# EAGLE design remote_display (EAGLE 7.2.0)
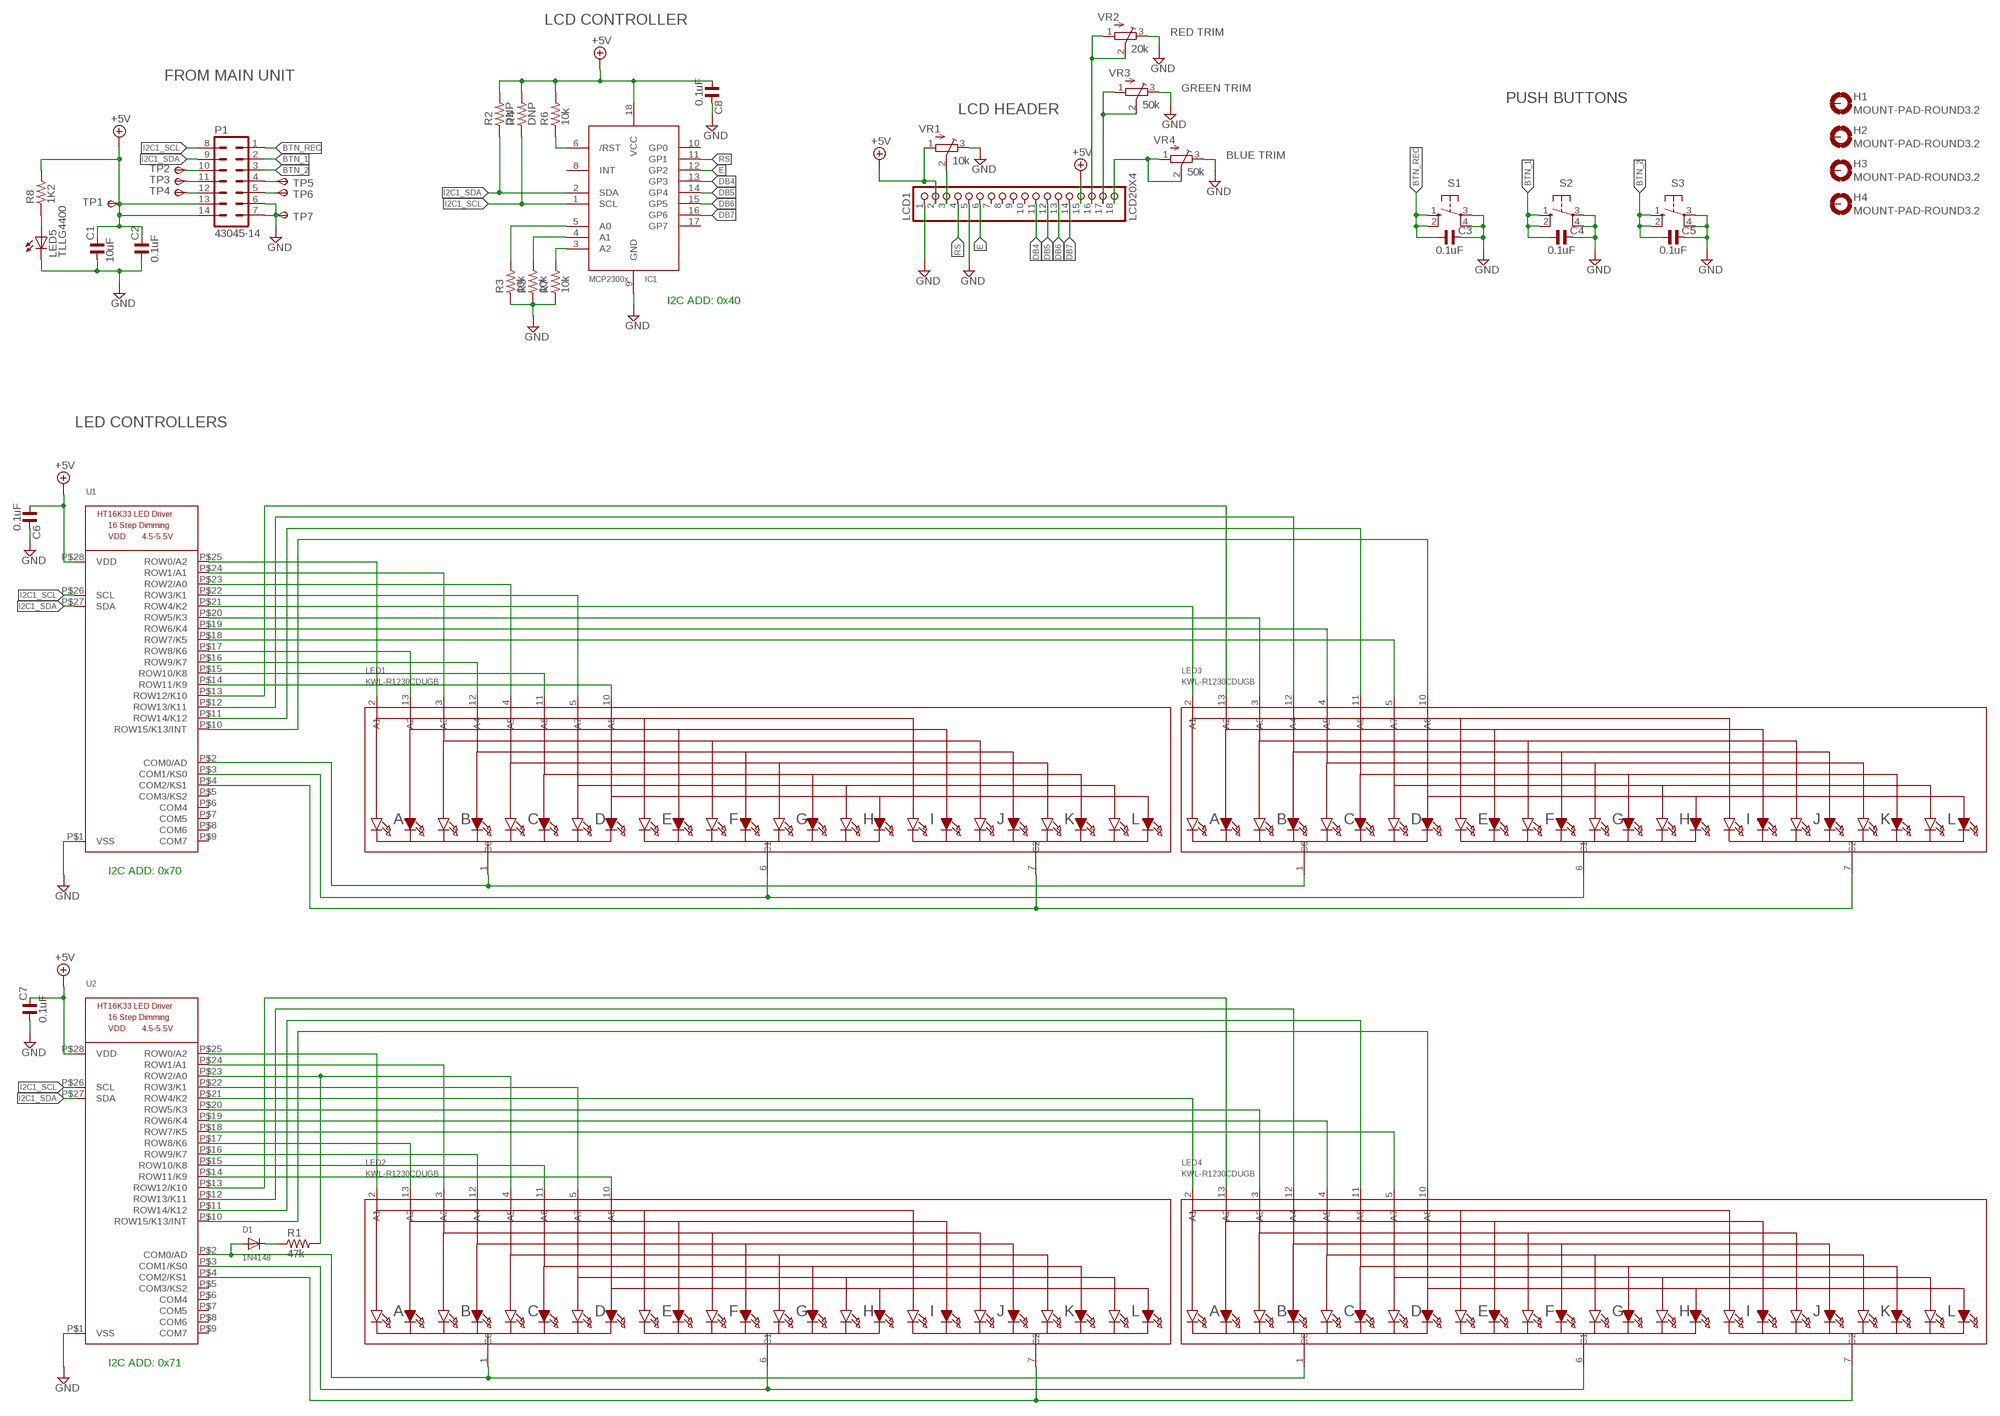
[diagram p0: schematic, sheet 1]

## Parts
C1  10uF  C_0805  [C0805]
C2  0.1uF  C_0805  [C0805]
C3  0.1uF  C_0805  [C0805]
C4  0.1uF  C_0805  [C0805]
C5  0.1uF  C_0805  [C0805]
C6  0.1uF  C_0805  [C0805]
C7  0.1uF  C_0805  [C0805]
C8  0.1uF  C_0805  [C0805]
D1  1N4148  DIODESOD-323F  [SOD-323F]
H1  MOUNT-PAD-ROUND3.2  [3,2-PAD]
H2  MOUNT-PAD-ROUND3.2  [3,2-PAD]
H3  MOUNT-PAD-ROUND3.2  [3,2-PAD]
H4  MOUNT-PAD-ROUND3.2  [3,2-PAD]
IC1  MCP2300X/SO  [SO18W]
LCD1  LCD20X4  [LCD20X4]
LED1  KWL-R1230CDUGB  [SEGMENT_BICOL_BL-AR12Z3010]
LED2  KWL-R1230CDUGB  [SEGMENT_BICOL_BL-AR12Z3010]
LED3  KWL-R1230CDUGB  [SEGMENT_BICOL_BL-AR12Z3010]
LED4  KWL-R1230CDUGB  [SEGMENT_BICOL_BL-AR12Z3010]
LED5  TLLG4400  [LED3MM]
P1  43045-14  [43045-14]
R1  47k  R_0805  [R0805]
R2  DNP  R_0805  [R0805]
R3  10k  R_0805  [R0805]
R4  DNP  R_0805  [R0805]
R5  10k  R_0805  [R0805]
R6  10k  R_0805  [R0805]
R7  10k  R_0805  [R0805]
R8  1K2  R_0805  [R0805]
S1  10-XX  [B3F-10XX]
S2  10-XX  [B3F-10XX]
S3  10-XX  [B3F-10XX]
TP1  TPSPAD1-13  [P1-13]
TP2  TPSPAD1-13  [P1-13]
TP3  TPSPAD1-13  [P1-13]
TP4  TPSPAD1-13  [P1-13]
TP5  TPSPAD1-13  [P1-13]
TP6  TPSPAD1-13  [P1-13]
TP7  TPSPAD1-13  [P1-13]
U1  HT16K33_SOP28  [SOP28_300MIL]
U2  HT16K33_SOP28  [SOP28_300MIL]
VR1  10k  TRIMPOTTC33X  [TC33X]
VR2  20k  TRIMPOTTC33X  [TC33X]
VR3  50k  TRIMPOTTC33X  [TC33X]
VR4  50k  TRIMPOTTC33X  [TC33X]

## Nets
+5V [Power]: C1.2 C2.2 C6.1 C7.2 C8.1 IC1.18(VCC) LCD1.2 LCD1.15 P1.13 P1.14 R2.2 R4.2 R6.2 R8.2 TP1.TP(PP) U1.P$28(VDD) U2.P$28(VDD) VR1.1(A)
BTN_1: C4.1 P1.2 S2.1(S) S2.2(S1)
BTN_2: C5.1 P1.3 S3.1(S) S3.2(S1)
BTN_REC: C3.1 P1.1 S1.1(S) S1.2(S1)
DB4: IC1.13(GP3) LCD1.11
DB5: IC1.14(GP4) LCD1.12
DB6: IC1.15(GP5) LCD1.13
DB7: IC1.16(GP6) LCD1.14
E: IC1.12(GP2) LCD1.6
GND [Ground]: C1.1 C2.1 C3.2 C4.2 C5.2 C6.2 C7.1 C8.2 IC1.9(GND) LCD1.1 LCD1.5 LED5.K(C) P1.6 P1.7 R3.1 R5.1 R7.1 S1.3(P) S1.4(P1) S2.3(P) S2.4(P1) S3.3(P) S3.4(P1) TP7.TP(PP) U1.P$1(VSS) U2.P$1(VSS) VR1.3(E) VR2.3(E) VR3.3(E) VR4.3(E)
I2C1_SCL: IC1.1(SCL) P1.8 R4.1 U1.P$26(SCL) U2.P$26(SCL)
I2C1_SDA: IC1.2(SDA) P1.9 R2.1 U1.P$27(SDA) U2.P$27(SDA)
N$1: LCD1.17 VR3.1(A) VR3.2(S)
N$2: D1.C R1.1
N$3: LCD1.3 VR1.2(S)
N$4: IC1.3(A2) R7.2
N$5: IC1.4(A1) R5.2
N$6: LED1.2(A1) U1.P$25(ROW0/A2)
N$7: LCD1.16 VR2.1(A) VR2.2(S)
N$8: LED1.7(C2) LED3.7(C2) U1.P$4(COM2/KS1)
N$9: IC1.6(/RST) R6.1
N$10: LED5.A R8.1
N$11: LED1.1(C0) LED3.1(C0) U1.P$2(COM0/AD)
N$12: LED1.6(C1) LED3.6(C1) U1.P$3(COM1/KS0)
N$13: LED1.3(A3) U1.P$24(ROW1/A1)
N$14: LED1.13(A2) U1.P$17(ROW8/K6)
N$15: LED1.12(A4) U1.P$16(ROW9/K7)
N$16: LED1.11(A6) U1.P$15(ROW10/K8)
N$17: LED1.10(A8) U1.P$14(ROW11/K9)
N$18: LED1.5(A7) U1.P$22(ROW3/K1)
N$19: LED1.4(A5) U1.P$23(ROW2/A0)
N$20: LED3.2(A1) U1.P$21(ROW4/K2)
N$21: LED3.3(A3) U1.P$20(ROW5/K3)
N$22: LED3.4(A5) U1.P$19(ROW6/K4)
N$23: LED3.5(A7) U1.P$18(ROW7/K5)
N$24: LED3.13(A2) U1.P$13(ROW12/K10)
N$25: IC1.5(A0) R3.2
N$26: P1.5 TP6.TP(PP)
N$27: LED3.12(A4) U1.P$12(ROW13/K11)
N$28: LED3.11(A6) U1.P$11(ROW14/K12)
N$29: LED3.10(A8) U1.P$10(ROW15/K13/INT)
N$30: D1.A LED2.1(C0) LED4.1(C0) U2.P$2(COM0/AD)
N$31: LED2.6(C1) LED4.6(C1) U2.P$3(COM1/KS0)
N$32: LED2.7(C2) LED4.7(C2) U2.P$4(COM2/KS1)
N$33: LED2.2(A1) U2.P$25(ROW0/A2)
N$34: LED2.3(A3) U2.P$24(ROW1/A1)
N$36: LED2.13(A2) U2.P$17(ROW8/K6)
N$37: LED2.12(A4) U2.P$16(ROW9/K7)
N$38: LED2.11(A6) U2.P$15(ROW10/K8)
N$39: LCD1.18 VR4.1(A) VR4.2(S)
N$40: LED2.10(A8) U2.P$14(ROW11/K9)
N$41: LED2.5(A7) U2.P$22(ROW3/K1)
N$42: LED2.4(A5) R1.2 U2.P$23(ROW2/A0)
N$43: LED4.2(A1) U2.P$21(ROW4/K2)
N$44: LED4.3(A3) U2.P$20(ROW5/K3)
N$45: LED4.4(A5) U2.P$19(ROW6/K4)
N$46: LED4.5(A7) U2.P$18(ROW7/K5)
N$47: LED4.13(A2) U2.P$13(ROW12/K10)
N$48: LED4.12(A4) U2.P$12(ROW13/K11)
N$49: LED4.11(A6) U2.P$11(ROW14/K12)
N$50: LED4.10(A8) U2.P$10(ROW15/K13/INT)
N$52: P1.4 TP5.TP(PP)
N$53: P1.12 TP4.TP(PP)
N$54: P1.11 TP3.TP(PP)
N$55: P1.10 TP2.TP(PP)
RS: IC1.11(GP1) LCD1.4
Unconnected: H1.B3,2(MOUNT) H2.B3,2(MOUNT) H3.B3,2(MOUNT) H4.B3,2(MOUNT) IC1.8(INT) IC1.10(GP0) IC1.17(GP7) LCD1.7 LCD1.8 LCD1.9 LCD1.10 U1.P$5(COM3/KS2) U1.P$6(COM4) U1.P$7(COM5) U1.P$8(COM6) U1.P$9(COM7) U2.P$5(COM3/KS2) U2.P$6(COM4) U2.P$7(COM5) U2.P$8(COM6) U2.P$9(COM7)

## Notes on the sheet
- LCD CONTROLLER
- RED TRIM
- FROM MAIN UNIT
- GREEN TRIM
- PUSH BUTTONS
- LCD HEADER
- BLUE TRIM
- I2C ADD: 0x40
- LED CONTROLLERS
- I2C ADD: 0x70
- I2C ADD: 0x71

## Library data of the parts
C1 = rc-master-smd:C_: NON-POLARIZED CAP; MPN: C2012X5R1E106K125AB; OC_NEWARK: 04X3278
C2-C8 = rc-master-smd:C_: NON-POLARIZED CAP; MPN: C2012X7R1H104K085AA; OC_NEWARK: 04X3288
D1 = Adafruit-bicolor-bargraph-24:DIODE: Diode SMADIODE - SMA Surface Mount Package 20V 1A Schottky Diode Digikey: 641-1014-6-ND DO-1N4148 - Through Hole Small Current Diode SOD-123 20V 1 A (.5mV Vf) Schottky Diode - Digikey: MBRX120TPMSCT-ND SOD-323 10V 570mA (.38mV Vf, 3ns) Schottky Diode - Digikey: ZLLS410CT-ND SOD-523 30V 30mA Schottky Diode (RB751S-40TE61) - Digikey: RB751S-40TE61CT-ND SOT23-R/W - SOT23 Package (R = Solder Paste/Reflow Ovens, W = Hand-Soldering) BAT54Film 40V 300mA - Digikey: 497-7162-1-ND; MPN: MMBT2222ALT3G; OC_NEWARK: 10N9478
H1-H4 = holes:MOUNT-PAD-ROUND: MOUNTING PAD, round; OC_NEWARK: unknown
IC1 = adafruit-i2cspilcdbackpack:MCP2300X: MCP23008 Inexpensive i2c i/o expander - 8 general purpose i/o pins with optional pullups; MF: MICROCHIP; MPN: MCP23008-E/SO; OC_NEWARK: 08J8738
LCD1 = dan:LCD20X4; OC_NEWARK: unknown
LED1-LED4 = Adafruit-bicolor-bargraph-24:KWL-R1230CDUGB; OC_NEWARK: unknown
LED5 = led:TLLG4400: Low Current (2mA) LED 3 mm Tinted Diffused Package color GREEN Source: Data sheet <http://www.farnell.com/datasheets/391098.pdf>; MF: VISHAY/TELEFUNKEN; MPN: TLLG4400; OC_FARNELL: 1612435; OC_NEWARK: 58K2496
P1 = con-molex-micro-fit:43045-14: HEADER; MPN: 43045-1400; OC_NEWARK: 55R8852
R1 = rc-master-smd:R_: RESISTOR; MPN: CRCW080547K0FKEAHP; OC_NEWARK: 41R4787
R2-R8 = rc-master-smd:R_: RESISTOR; MF: VISHAY/DALE; MPN: CRCW080510K0FKTA; OC_NEWARK: 05F1511
S1-S3 = switch-omron:10-XX: OMRON SWITCH; OC_FARNELL: 176432; OC_NEWARK: unknown
TP1-TP7 = testpad:TPS: TEST PIN; OC_NEWARK: unknown
U1 U2 = Adafruit-bicolor-bargraph-24:HT16K33_SOP28; OC_NEWARK: unknown
VR1 = adafruit-i2cspilcdbackpack:TRIMPOT: SMT trimmer potentiometer part number TC33X http://www.ladyada.net/library/eagle; MF: BOURNS, INC.; MPN: TC33X-2-103E; OC_NEWARK: 60H9648
VR2 = adafruit-i2cspilcdbackpack:TRIMPOT: SMT trimmer potentiometer part number TC33X http://www.ladyada.net/library/eagle; MPN: TC33X-2-203E; OC_NEWARK: 97M3839
VR3 VR4 = adafruit-i2cspilcdbackpack:TRIMPOT: SMT trimmer potentiometer part number TC33X http://www.ladyada.net/library/eagle; MPN: TC33X-2-503E; OC_NEWARK: 97M3841

## Net classes
1 Ground: width 0.635 mm
2 Power: width 0.508 mm

## Board
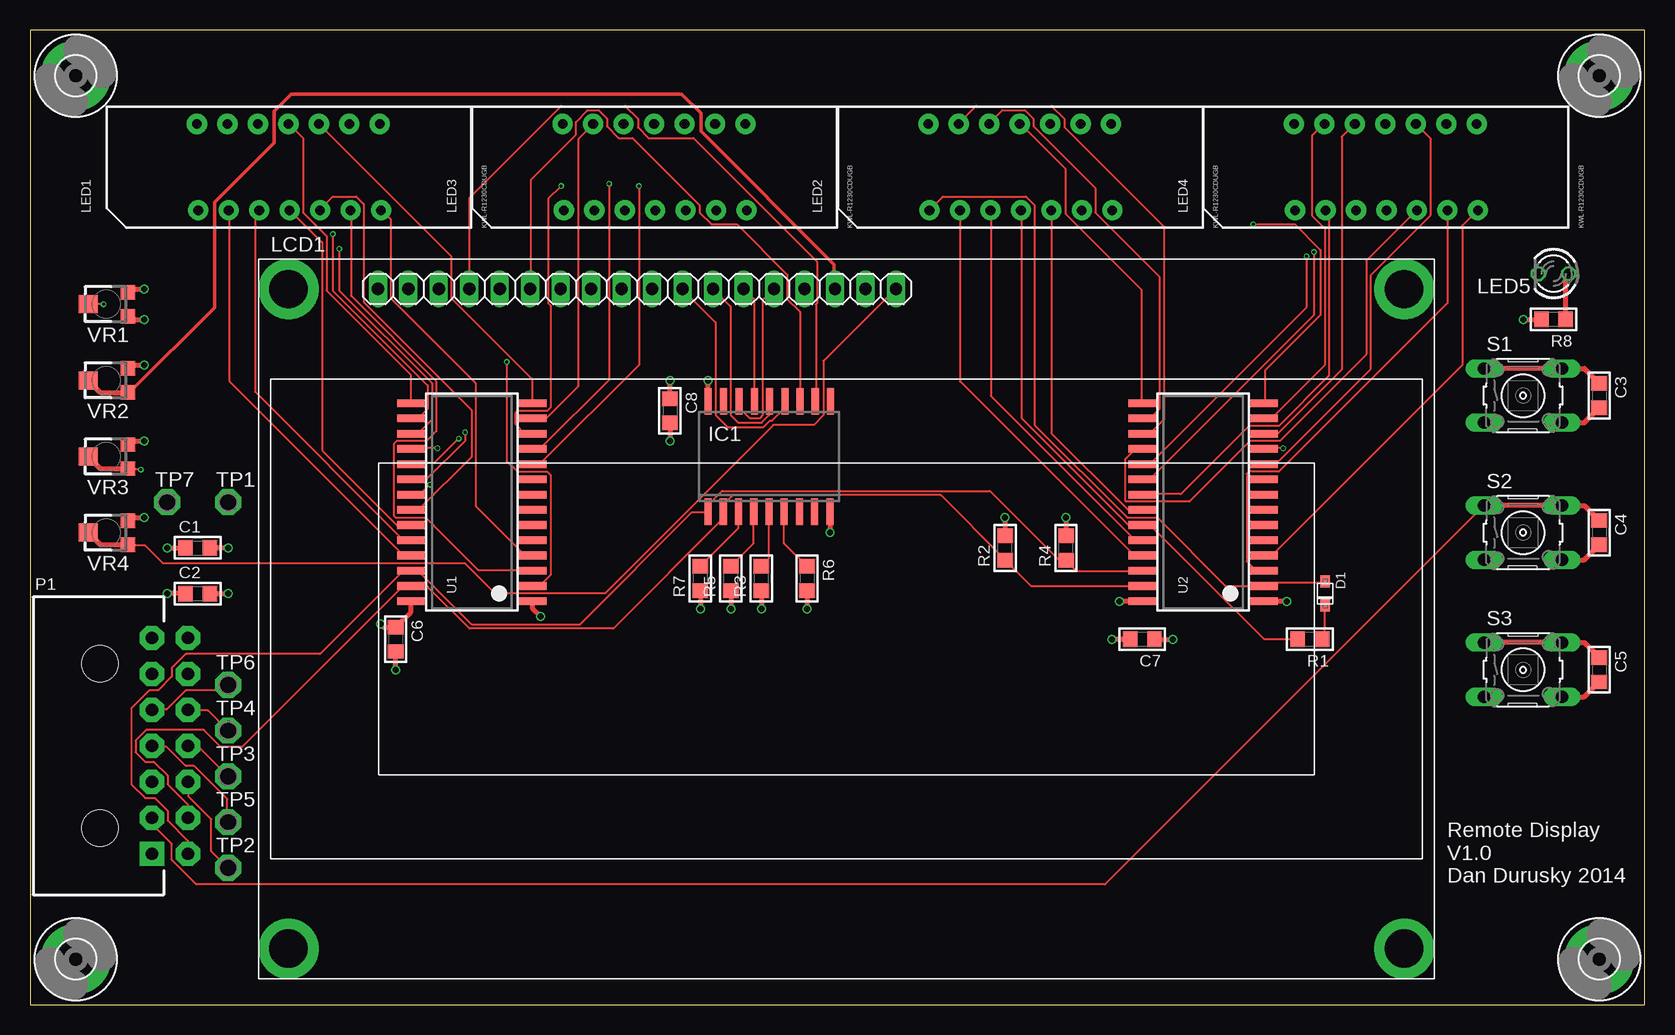
[diagram p1: board, top side]
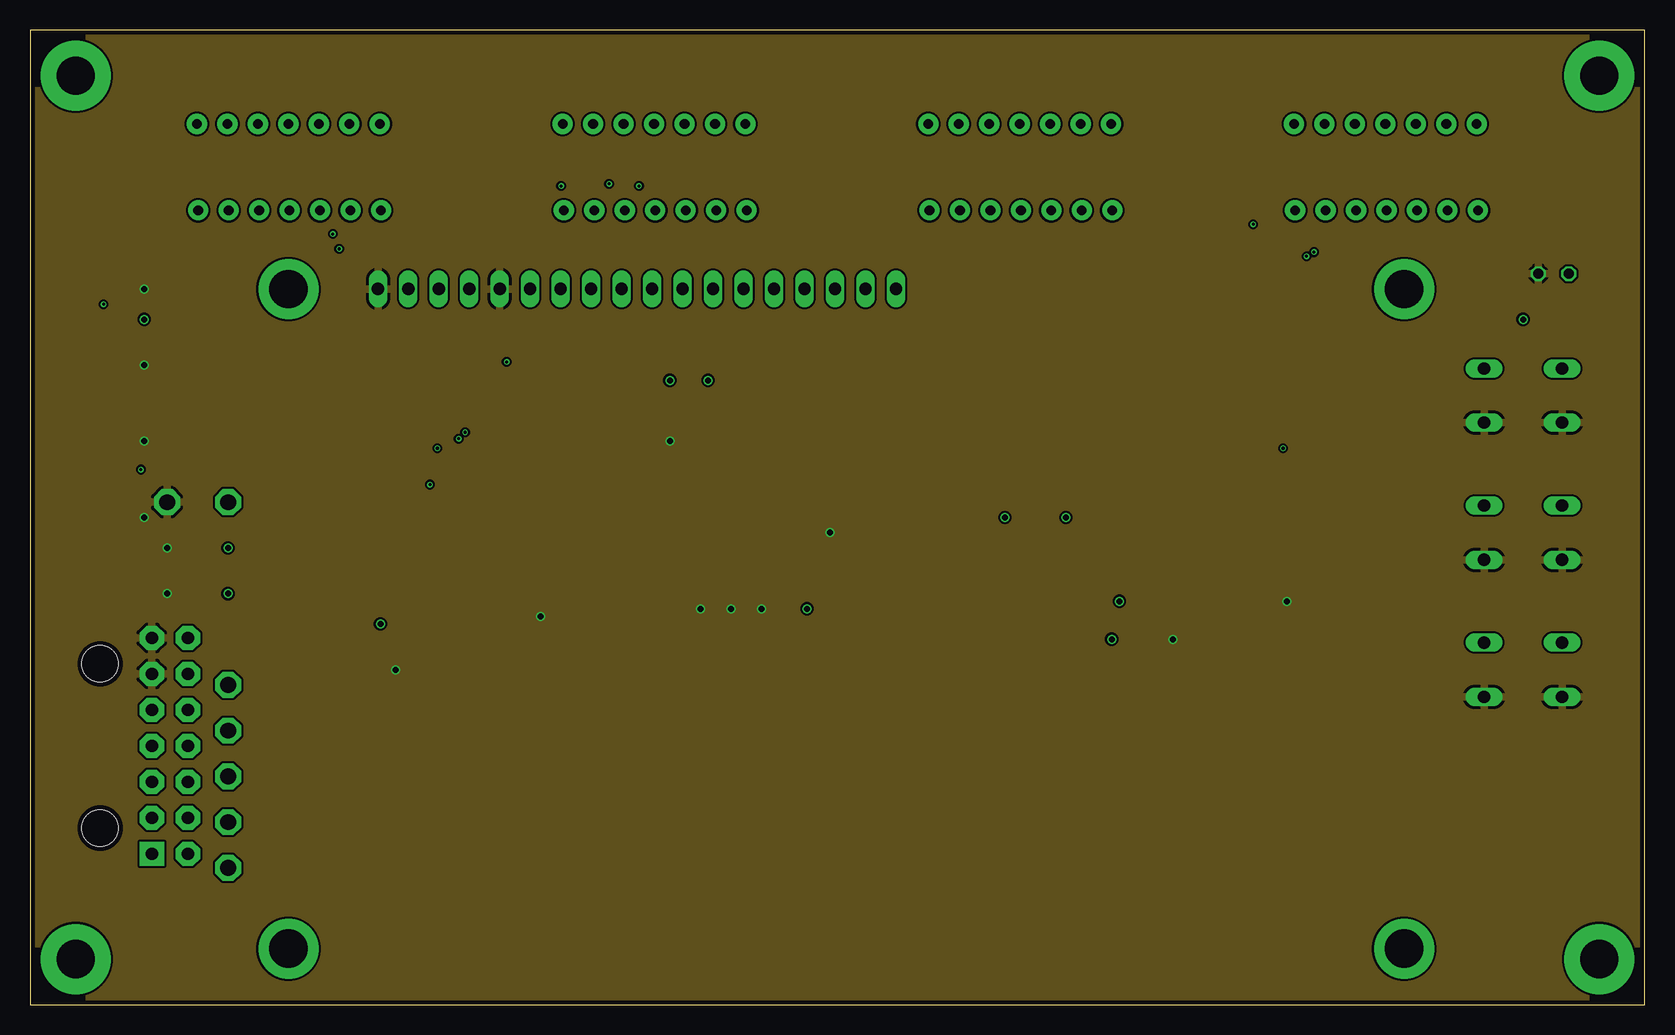
[diagram p2: board, inner layer GroundPlane]
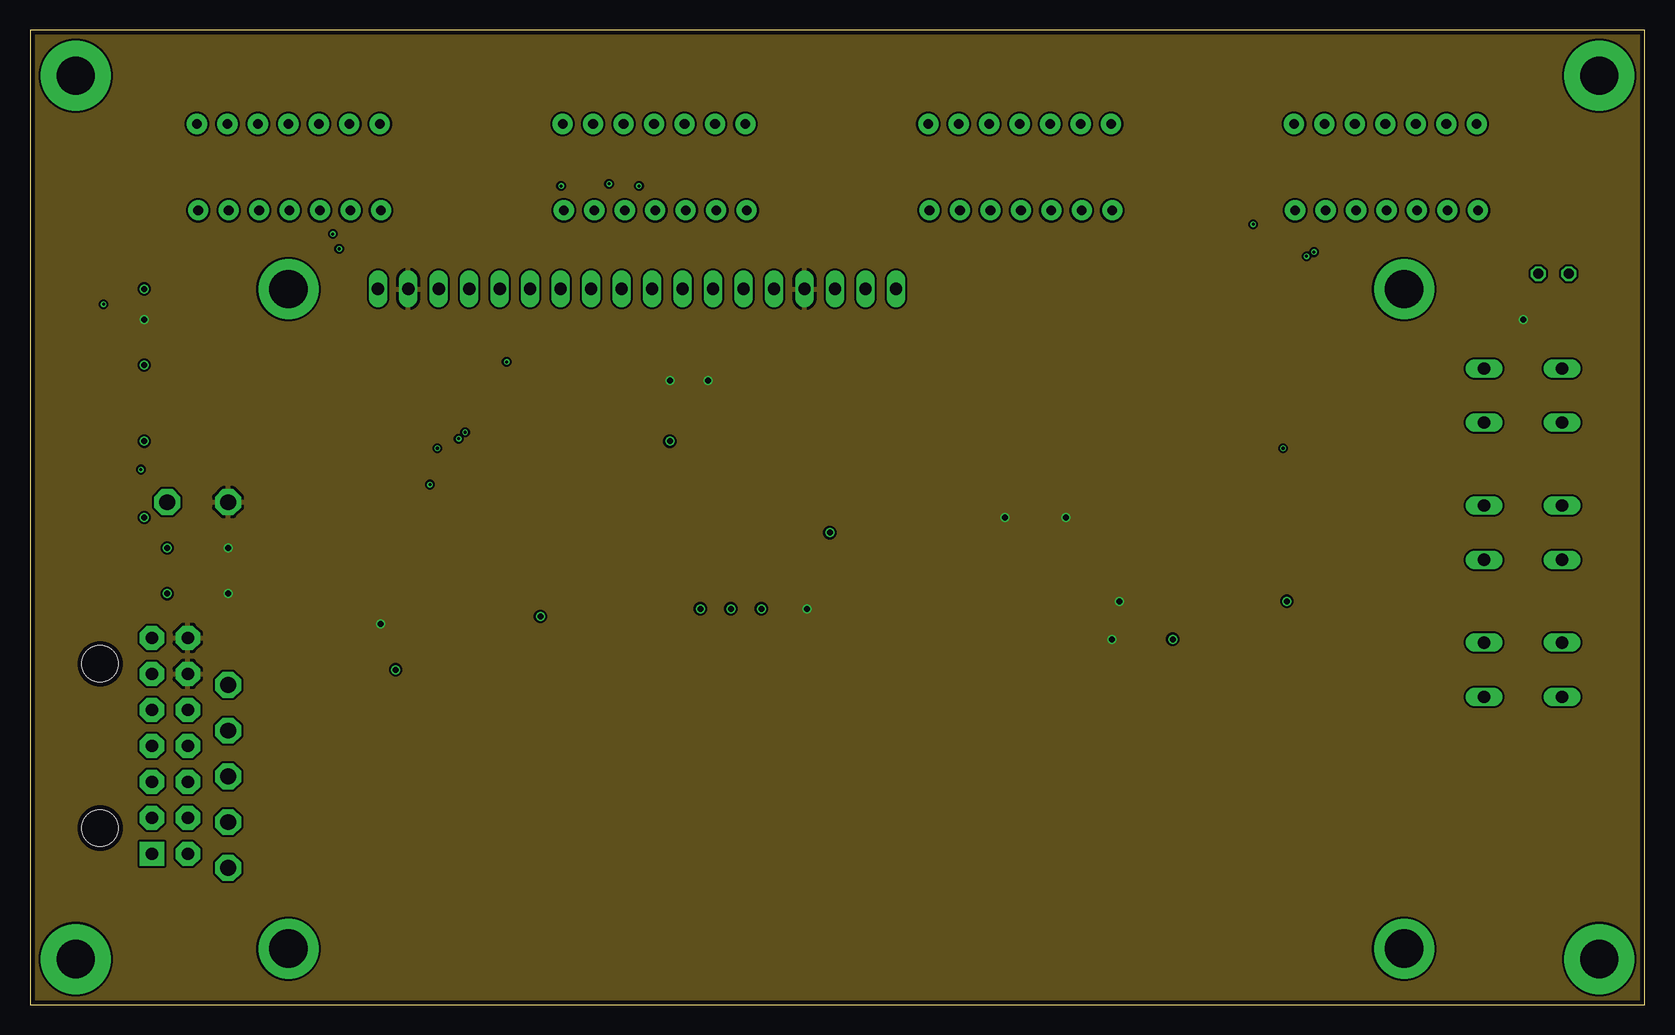
[diagram p3: board, inner layer 5vPlane]
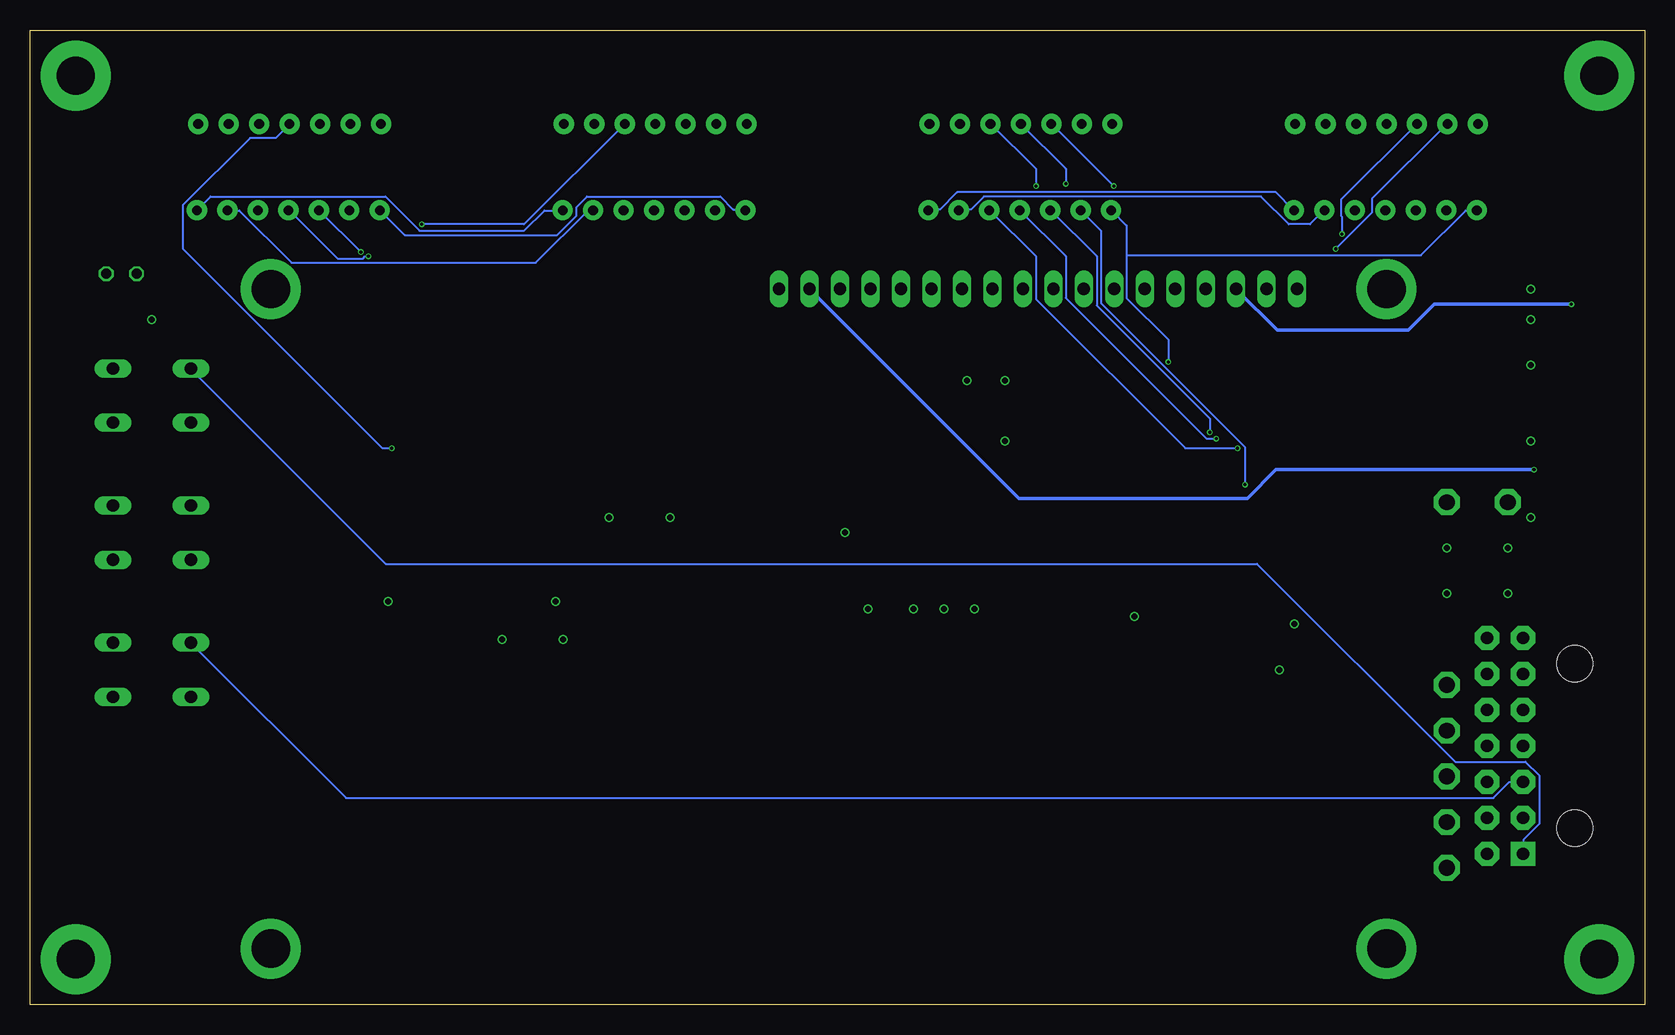
[diagram p4: board, bottom side, seen from below]

Size 134.62 x 81.28 mm. Coordinates in mm from the lower left corner, seen from the top.
Outline: 0,0 134.62,0 134.62,81.28 0,81.28 0,0
Copper layers (1*2*15*16): TopSignals 0.035559375mm / dielectric 0.17018125mm / GroundPlane 0.01778125mm / dielectric 47mil / 5vPlane 0.01778125mm / dielectric 0.17018125mm / BottomSignals 0.035559375mm
Design rules "OSHPark-4layer *": minimum track width 7mil, minimum drill 10mil, track to track 7mil, track to pad 7mil, pad to pad 7mil, via to via 7mil, smd to smd 7mil, copper to edge 15mil, drill to drill 6mil, minimum pad ring 4mil, minimum via ring 4mil, stop-mask expansion 4mil, vias tented up to drill 0mil, thermal gap 10mil

### Footprints (pad centres in the part's own frame; a part is rotated, then mirrored left to right if it is on the bottom)
C0805 = smd 1.2 x 1.3: 1 -1.016,0; 2 1.016,0
SOD-323F = smd 1 x 0.8: A -1,0; C 1,0
3,2-PAD = drill 3.2 pad 5.842: B3,2 0,0
SO18W = smd 0.6 x 2.2: 1 -4.445,-4.6; 2 -3.175,-4.6; 3 -1.905,-4.6; 4 -0.635,-4.6; 5 0.635,-4.6; 6 1.905,-4.6; 7 3.175,-4.6; 8 4.445,-4.6; 9 5.715,-4.6; 10 5.775,4.6; 11 4.505,4.6; 12 3.235,4.6; 13 1.965,4.6; 14 0.695,4.6; 15 -0.575,4.6; 16 -1.845,4.6; 17 -3.145,4.6; 18 -4.445,4.6
LCD20X4 = drill 1.016 long: 1 9.95,57.51; 2 12.49,57.51; 3 15.03,57.51; 4 17.57,57.51; 5 20.11,57.51; 6 22.65,57.51; 7 25.19,57.51; 8 27.73,57.51; 9 30.27,57.51; 10 32.81,57.51; 11 35.35,57.51; 12 37.89,57.51; 13 40.43,57.51; 14 42.97,57.51; 15 45.51,57.51; 16 48.05,57.51; 17 50.59,57.51; 18 53.13,57.51 | drill 3.2 pad 5: P$1 2.5,57.5; P$2 2.5,2.5; P$3 95.5,2.5; P$4 95.5,57.5
SEGMENT_BICOL_BL-AR12Z3010 = drill 0.8 pad 1.676: 1 -3.6,7.57; 2 -3.6,5.03; 3 -3.6,2.49; 4 -3.6,-0.05; 5 -3.6,-2.59; 6 -3.6,-5.13; 7 -3.6,-7.67; 8 3.6,-7.57; 9 3.6,-5.03; 10 3.6,-2.49; 11 3.6,0.05; 12 3.6,2.59; 13 3.6,5.13; 14 3.6,7.67
LED3MM = drill 0.813 octagon: A -1.27,0; K 1.27,0
43045-14 = drill 1.016 pad 2.032 square: 1 9,0 | drill 1.016 pad 2.032 octagon: 2 6,0; 3 3,0; 4 0,0; 5 -3,0; 6 -6,0; 7 -9,0; 8 9,3; 9 6,3; 10 3,3; 11 0,3; 12 -3,3; 13 -6,3; 14 -9,3 | hole 3: -6.85,-4.32; 6.85,-4.32
R0805 = smd 1.2 x 1.3: 1 -1.016,0; 2 1.016,0
B3F-10XX = drill 1.016 long: 1 -3.251,2.261; 2 3.251,2.261; 3 -3.251,-2.261; 4 3.251,-2.261
P1-13 = drill 1.321 pad 2.159 octagon: TP 0,0
SOP28_300MIL = smd 0.635 x 2.286: P$1 -8.255,-5.08; P$2 -6.985,-5.08; P$3 -5.715,-5.08; P$4 -4.445,-5.08; P$5 -3.175,-5.08; P$6 -1.905,-5.08; P$7 -0.635,-5.08; P$8 0.635,-5.08; P$9 1.905,-5.08; P$10 3.175,-5.08; P$11 4.445,-5.08; P$12 5.715,-5.08; P$13 6.985,-5.08; P$14 8.255,-5.08; P$15 8.255,5.08; P$16 6.985,5.08; P$17 5.715,5.08; P$18 4.445,5.08; P$19 3.175,5.08; P$20 1.905,5.08; P$21 0.635,5.08; P$22 -0.635,5.08; P$23 -1.905,5.08; P$24 -3.175,5.08; P$25 -4.445,5.08; P$26 -5.715,5.08; P$27 -6.985,5.08; P$28 -8.255,5.08
TC33X = smd 1.2 x 1.2: 1 -1,-1.825; 3 1,-1.825 | smd 1.5 x 1.6: 2 0,1.5

### Placement (x,y rotation side)
C1  13.97,38.1 0 top
C2  13.97,34.29 0 top
C3  130.81,50.8 270 top
C4  130.81,39.37 270 top
C5  130.81,27.94 270 top
C6  30.48,30.48 270 top
C7  92.71,30.48 180 top
C8  53.34,49.53 270 top
D1  107.95,34.29 270 top
H1  3.81,3.81 0 top
H2  130.81,3.81 0 top
H3  130.81,77.47 0 top
H4  3.81,77.47 0 top
IC1  60.96,45.72 0 top
LCD1  19.05,2.18 0 top
LED1  21.59,69.85 90 top
LED2  82.55,69.85 90 top
LED3  52.07,69.85 90 top
LED4  113.03,69.85 90 top
LED5  127,60.96 180 top
P1  10.16,21.59 270 top
R1  106.68,30.48 180 top
R2  81.28,38.1 90 top
R3  60.96,35.56 90 top
R4  86.36,38.1 90 top
R5  58.42,35.56 90 top
R6  64.77,35.56 270 top
R7  55.88,35.56 90 top
R8  127,57.15 180 top
S1  124.46,50.8 0 top
S2  124.46,39.37 0 top
S3  124.46,27.94 0 top
TP1  16.51,41.91 0 top
TP2  16.51,11.43 0 top
TP3  16.51,19.05 0 top
TP4  16.51,22.86 0 top
TP5  16.51,15.24 0 top
TP6  16.51,26.67 0 top
TP7  11.43,41.91 0 top
U1  36.83,41.91 90 top
U2  97.79,41.91 90 top
VR1  6.35,58.42 90 top
VR2  6.35,52.07 90 top
VR3  6.35,45.72 90 top
VR4  6.35,39.37 90 top

### Tracks (layer width: path | path; a pad name or v marks a point on that pad's centre or on a via)
+5V  (via drill 0.5)
  TopSignals 0.406: U1.P$28 31.75,32.77 C6.1 29.46,31.5 v29.21,31.75 | C2.2 v16.51,34.29 | IC1.18 v56.52,52.07 | C8.1 53.34,51.21 v53.34,52.07 | R6.2 v64.77,33.02 | U2.P$28 v90.81,33.66 | C7.2 v90.17,30.48 | v124.46,57.15 R8.2 | v81.28,40.64 R2.2 | v86.36,40.64 R4.2 | VR1.1 8.45,57.15 v9.53,57.15 | v16.51,38.1 C1.2
  pour 5vPlane: -1.27,82.55 135.89,82.55 135.89,-1.27 -1.27,-1.27
BTN_1
  TopSignals 0.178: P1.2 10.22,15.56 10.22,15.02 11.82,13.42 11.82,12.09 13.87,10.05 89.61,10.05 121.08,41.52 S2.1
  TopSignals 0.406: C4.1 129.56,41.63 S2.2 S2.1
BTN_2
  TopSignals 0.406: C5.1 129.56,30.2 S3.2 S3.1
  BottomSignals 0.178: P1.3 10.22,18.58 11.29,18.58 12.62,17.25 108.28,17.25 121.17,30.14 S3.1
BTN_REC
  TopSignals 0.406: C3.1 129.56,53.06 S1.2 S1.1
  BottomSignals 0.178: P1.1 10.13,12.62 10.13,13.78 8.8,15.11 8.8,19.11 9.96,20.27 15.82,20.27 32.33,36.78 104.97,36.78 121.17,52.98 S1.1
DB4
  TopSignals 0.178: IC1.13 62.85,50.32 62.85,49.7 61.87,48.72 61.7,48.72 61.16,48.18 58.14,48.18 57.16,49.16 57.16,56.9 54.41,59.65 LCD1.11
DB5
  TopSignals 0.178: IC1.14 61.61,50.32 61.61,49.16 60.98,48.54 59.03,48.54 58.41,49.16 58.41,58.23 56.98,59.65 LCD1.12
DB6
  TopSignals 0.178: IC1.15 60.36,50.41 60.36,58.85 59.56,59.65 LCD1.13
DB7
  TopSignals 0.178: IC1.16 59.12,49.78 60.01,48.9 60.81,48.9 61.07,49.16 61.07,58.76 61.96,59.65 LCD1.14
E
  TopSignals 0.178: IC1.12 64.19,50.41 64.19,57.78 63.12,58.85 63.12,60.9 58.94,65.08 56.81,65.08 55.83,66.05 55.83,66.67 50.23,72.28 49.07,72.28 48.09,73.25 48.09,73.88 47.38,74.59 46.49,74.59 45.52,73.61 45.52,72.54 41.78,68.81 41.78,59.74 LCD1.6
GND  (via drill 0.5)
  TopSignals 0.406: VR2.3 8.45,53.34 v9.53,53.34 | VR4.3 8.45,40.64 v9.53,40.64 | C2.1 12.7,34.29 v11.43,34.29 | v30.48,27.94 C6.2 | v42.55,32.38 41.91,33.02 U1.P$1 | R7.1 v55.88,33.02 | R5.1 v58.42,33.02 | R3.1 v60.96,33.02 | IC1.9 v66.67,39.37 | C8.2 v53.34,46.99 | v104.78,33.66 U2.P$1 | C7.1 v95.25,30.48 | S3.4 129.56,25.68 C5.2 | S2.4 129.56,37.11 C4.2 | S1.4 129.56,48.54 C3.2 | VR3.3 8.45,46.99 v9.53,46.99 | VR1.3 8.45,59.69 v9.53,59.69 | v11.43,38.1 C1.1
  pour GroundPlane: -1.27,82.55 -1.27,-1.27 135.89,-1.27 135.89,82.55
I2C1_SCL
  TopSignals 0.178: U2.P$26 87.25,36.2 R4.1 86.23,37.16 85.7,37.16 80.01,42.85 57.7,42.85 56.54,41.69 56.54,41.16 IC1.1 56.45,41.07 55.21,41.07 45.87,31.74 36.8,31.74 32.36,36.18 31.83,36.18 U1.P$26 31.74,36.18 31.11,36.18 24.18,29.25 12.98,29.25 11.82,28.09 11.82,27.38 10.67,26.23 9.96,26.23 8.45,24.71 8.45,18.4 9.6,17.25 10.4,17.25 11.47,16.18 11.47,15.38 13.16,13.69 13.16,12.62 P1.8
I2C1_SDA
  TopSignals 0.178: U2.P$27 83.44,34.92 R2.1 81.17,37.25 75.92,42.49 58.59,42.49 57.78,41.69 57.78,41.16 IC1.2 57.78,41.07 57.78,40.54 48.63,31.38 36.63,31.38 33.16,34.85 31.83,34.85 U1.P$27 31.74,34.85 31.03,34.85 17.69,21.51 15.91,21.51 14.49,22.94 9.69,22.94 8.8,22.05 8.8,21.07 9.6,20.27 10.31,20.27 11.47,19.11 11.47,18.4 13.16,16.71 13.16,15.65 P1.9
N$1  (via drill 0.25)
  TopSignals 0.178: v9.25,44.63 8.36,44.63 VR3.1
  TopSignals 0.406: VR3.2 5.85,44.72 VR3.1
  BottomSignals 0.178: 69.61,59.65 LCD1.17
  BottomSignals 0.305: v9.25,44.63 30.75,44.63 33.16,42.22 52.17,42.22 69.61,59.65
N$2
  TopSignals 0.178: D1.C 107.92,33.25 107.92,30.67 107.75,30.49 R1.1
N$3  (via drill 0.25)
  TopSignals 0.178: v6.13,58.41 4.89,58.41 VR1.2
  BottomSignals 0.178: 34.05,59.65 LCD1.3
  BottomSignals 0.305: v6.13,58.41 17.58,58.41 19.72,56.26 30.66,56.26 34.05,59.65
N$4
  TopSignals 0.178: R7.2 59.05,39.75 IC1.3
N$5
  TopSignals 0.178: R5.2 60.33,38.48 IC1.4
N$6
  TopSignals 0.178: U1.P$25 31.74,37.52 31.11,37.52 16.62,52.01 16.62,66.23 LED1.2
N$7
  TopSignals 0.178: 8.36,51.12 VR2.1 | 67.03,59.74 LCD1.16
  TopSignals 0.305: 8.36,51.12 15.38,58.14 15.38,66.92 20.36,71.89 20.36,74.51 21.78,75.93 54.32,75.93 55.92,74.33 55.92,72.82 67.03,61.71 67.03,59.74
  TopSignals 0.406: VR2.2 5.85,51.07 VR2.1
N$8
  TopSignals 0.178: U1.P$4 41.87,37.52 41.25,37.52 37.16,41.6 37.16,51.83 30.05,58.94 30.05,65.52 29.34,66.23 LED1.7
  BottomSignals 0.178: LED3.7 59.65,66.32 58.76,66.32 57.34,67.74 30.76,67.74 29.34,66.32 LED1.7
N$9
  TopSignals 0.178: R6.1 62.87,38.48 IC1.6
N$10
  TopSignals 0.406: R8.1 128.02,60.71 LED5.A
N$11  (via drill 0.25)
  TopSignals 0.178: v39.74,53.61 39.74,45.34 40.63,44.45 43.12,44.45 43.38,44.18 43.38,35.83 42.49,34.94 41.96,34.94 U1.P$2
  BottomSignals 0.178: v39.74,53.61 39.74,55.47 43.2,58.94 43.2,62.5 | 43.2,62.5 43.2,64.99 44.45,66.23 LED3.1 | 43.2,62.5 18.67,62.5 14.94,66.23 14.05,66.23 LED1.1
N$12
  TopSignals 0.178: U1.P$3 41.87,36.27 37.34,36.27 32.98,40.63 30.49,40.63 30.32,40.8 30.32,46.76 30.58,47.03 33.07,47.03 33.87,47.83 33.87,52.01 26.76,59.12 26.76,66.23 LED1.6
  BottomSignals 0.178: LED3.6 57.16,66.32 56.19,66.32 55.12,67.39 32,67.39 29.69,65.08 27.91,65.08 26.76,66.23 LED1.6
N$13
  TopSignals 0.178: U1.P$24 31.74,38.76 31.11,38.76 18.76,51.12 18.76,65.96 19.02,66.23 LED1.3
N$14  (via drill 0.25)
  TopSignals 0.178: v25.78,63.03 25.78,59.56 33.52,51.83 33.52,48.81 32.36,47.65 31.83,47.65 U1.P$17
  BottomSignals 0.178: v25.78,63.03 22.76,66.05 22.76,67.21 16.54,73.43 LED1.13
N$15  (via drill 0.25)
  TopSignals 0.178: v25.25,64.28 25.25,59.56 33.16,51.65 33.16,49.7 32.36,48.9 31.83,48.9 U1.P$16
  BottomSignals 0.178: v25.25,64.28 25.25,65.7 25.34,65.79 25.34,67.12 19.02,73.43 LED1.12
N$16
  TopSignals 0.178: U1.P$15 31.74,50.23 31.74,52.54 24.71,59.56 24.71,64.1 22.76,66.05 22.76,72.28 21.6,73.43 LED1.11
N$17
  TopSignals 0.178: U1.P$14 41.87,50.23 41.87,52.18 35.12,58.94 35.12,62.41 24.09,73.43 LED1.10
N$18
  TopSignals 0.178: U1.P$22 31.83,41.34 32.45,41.34 36.8,45.7 36.8,49.61 27.83,58.59 27.83,66.76 27.2,67.39 25.25,67.39 24.18,66.32 LED1.5
N$19
  TopSignals 0.178: U1.P$23 31.74,40.01 30.58,40.01 24.36,46.23 24.36,63.56 21.69,66.23 LED1.4
N$20  (via drill 0.25)
  TopSignals 0.178: v33.34,43.38 32.54,42.58 31.83,42.58 U1.P$21
  BottomSignals 0.178: v33.34,43.38 33.34,46.49 45.34,58.5 45.34,64.54 47.03,66.23 LED3.2
N$21  (via drill 0.25)
  TopSignals 0.178: v36.27,47.74 36.27,47.03 33.07,43.83 31.83,43.83 U1.P$20
  BottomSignals 0.178: v36.27,47.74 36.27,48.9 45.7,58.32 45.7,62.41 49.52,66.23 LED3.3
N$22  (via drill 0.25)
  TopSignals 0.178: v35.74,47.21 33.69,45.16 31.83,45.16 U1.P$19
  BottomSignals 0.178: v35.74,47.21 36.54,47.21 48.27,58.94 48.27,62.41 52.09,66.23 LED3.4
N$23  (via drill 0.25)
  TopSignals 0.178: v33.96,46.41 31.83,46.41 U1.P$18
  BottomSignals 0.178: v33.96,46.41 38.32,46.41 50.76,58.85 50.76,62.41 54.59,66.23 LED3.5
N$24
  TopSignals 0.178: U1.P$13 41.96,48.9 43.03,48.9 45.7,51.56 45.7,72.19 46.94,73.43 LED3.13
N$25
  TopSignals 0.178: R3.2 61.59,37.21 IC1.5
N$26
  TopSignals 0.178: P1.5 10.22,24.62 11.38,24.62 12.98,26.23 16,26.23 16.45,26.67 TP6.TP
N$27  (via drill 0.25)
  TopSignals 0.178: v44.27,68.28 43.2,67.21 43.2,58.5 43.38,58.32 43.38,49.78 43.12,49.52 40.63,49.52 40.45,49.34 40.45,48.45 41.25,47.65 41.87,47.65 U1.P$12
  BottomSignals 0.178: v44.27,68.28 49.43,73.43 LED3.12
N$28  (via drill 0.25)
  TopSignals 0.178: v48.27,68.45 48.27,52.09 42.58,46.41 41.96,46.41 U1.P$11
  BottomSignals 0.178: v48.27,68.45 48.27,69.7 52.01,73.43 LED3.11
N$29  (via drill 0.25)
  TopSignals 0.178: v50.76,68.28 50.76,53.34 42.58,45.16 41.96,45.16 U1.P$10
  BottomSignals 0.178: v50.76,68.28 50.76,69.7 54.5,73.43 LED3.10
N$30
  TopSignals 0.178: D1.A 107.92,35.2 103.21,35.2 102.95,34.94 U2.P$2 102.86,34.94 99.66,34.94 93.97,40.63 91.48,40.63 83.74,48.36 83.74,66.67 83.03,67.39 76.1,67.39 75.03,66.32 LED2.1
  BottomSignals 0.178: LED2.1 75.03,66.32 76.01,66.32 77.08,67.39 88.19,67.39 89.08,66.5 89.08,65.79 90.68,64.19 103.39,64.19 105.44,66.23 LED4.1
N$31
  TopSignals 0.178: U2.P$3 102.86,36.27 102.15,36.27 101.44,36.98 101.44,44.27 101.61,44.45 104.1,44.45 118.15,58.5 118.15,66.23 LED4.6
  BottomSignals 0.178: LED2.6 87.74,66.23 88.1,66.23 92.46,61.87 112.81,61.87 117.17,66.23 118.15,66.23 LED4.6
N$32
  TopSignals 0.178: U2.P$4 102.95,37.52 103.57,37.52 119.39,53.34 119.39,64.99 120.64,66.23 LED4.7
  BottomSignals 0.178: LED2.7 90.23,66.23 91.75,66.23 93.43,64.54 102.15,64.54 104.99,67.39 119.57,67.39 120.64,66.32 LED4.7
N$33
  TopSignals 0.178: U2.P$25 92.63,37.52 92.01,37.52 77.52,52.01 77.52,66.23 LED2.2
N$34
  TopSignals 0.178: U2.P$24 92.63,38.76 92.1,38.76 80.1,50.76 80.1,66.23 LED2.3
N$36
  TopSignals 0.178: U2.P$17 92.72,47.65 93.34,47.65 94.5,48.81 94.5,64.9 86.23,73.17 86.23,73.88 85.17,74.94 78.85,74.94 77.43,73.52 LED2.13
N$37
  TopSignals 0.178: U2.P$16 92.72,48.9 93.34,48.9 94.14,49.7 94.14,60.72 88.81,66.05 88.81,68.1 83.66,73.25 83.66,73.88 82.94,74.59 81.08,74.59 80.01,73.52 LED2.12
N$38
  TopSignals 0.178: U2.P$15 92.63,50.23 92.63,59.65 86.32,65.96 86.32,69.7 82.59,73.43 LED2.11
N$39
  TopSignals 0.178: VR4.1 8.36,38.32 9.59,38.32 11.1,36.8 36.27,36.8 38.76,34.31 47.92,34.31 61.96,48.36 65.34,48.36 66.14,49.16 66.14,53.7 72.1,59.65 LCD1.18
  TopSignals 0.406: VR4.2 5.85,38.37 VR4.1
N$40  (via drill 0.25)
  TopSignals 0.178: v101.97,65.08 105.44,65.08 107.57,62.94 107.57,57.52 102.95,52.9 102.95,50.23 U2.P$14
  BottomSignals 0.178: v101.97,65.08 93.43,65.08 85.08,73.43 LED2.10
N$41
  TopSignals 0.178: U2.P$22 92.63,41.34 91.48,41.34 85.17,47.65 85.17,66.23 LED2.5
N$42
  TopSignals 0.178: R1.2 105.61,30.49 102.86,30.49 93.34,40.01 92.72,40.01 U2.P$23 92.63,40.01 91.57,40.01 82.68,48.9 82.68,66.23 LED2.4
N$43
  TopSignals 0.178: U2.P$21 92.72,42.58 95.92,42.58 101.61,48.27 104.1,48.27 108.28,52.45 108.28,65.96 108.01,66.23 LED4.2
N$44  (via drill 0.25)
  TopSignals 0.178: v107.04,62.76 107.04,57.52 93.34,43.83 92.72,43.83 U2.P$20
  BottomSignals 0.178: v107.04,62.76 110.5,66.23 LED4.3
N$45  (via drill 0.25)
  TopSignals 0.178: v106.41,62.41 106.41,58.14 93.43,45.16 92.72,45.16 U2.P$19
  BottomSignals 0.178: v106.41,62.41 106.68,62.41 106.86,62.23 108.99,62.23 112.99,66.23 LED4.4
N$46
  TopSignals 0.178: U2.P$18 92.63,46.32 92.1,46.32 91.3,45.52 91.3,42.05 91.39,41.96 96.63,41.96 101.7,47.03 104.19,47.03 111.39,54.23 111.39,62.05 115.57,66.23 LED4.5
N$47
  TopSignals 0.178: U2.P$13 102.95,48.9 103.48,48.9 107.92,53.34 107.92,64.72 106.86,65.79 106.86,72.45 107.84,73.43 LED4.13
N$48
  TopSignals 0.178: U2.P$12 102.95,47.65 104.01,47.65 109.35,52.98 109.35,72.36 110.41,73.43 LED4.12
N$49  (via drill 0.25)
  TopSignals 0.178: v104.46,46.41 102.95,46.41 U2.P$11
  BottomSignals 0.178: v104.46,46.41 105.26,46.41 121.88,63.03 121.88,66.67 116.28,72.28 114.15,72.28 112.99,73.43 LED4.11
N$50
  TopSignals 0.178: U2.P$10 102.95,45.16 103.92,45.16 111.75,52.98 111.75,60.81 116.73,65.79 116.73,72.28 115.57,73.43 LED4.10
N$52
  TopSignals 0.178: P1.4 10.22,21.51 11.38,21.51 12.98,19.91 13.69,19.91 16.45,17.16 16.45,15.29 TP5.TP
N$53
  TopSignals 0.178: P1.12 13.25,24.54 14.85,24.54 16.45,22.94 TP4.TP
N$54
  TopSignals 0.178: P1.11 13.25,21.51 14.05,21.51 16.45,19.11 TP3.TP
N$55
  TopSignals 0.178: P1.10 13.25,18.58 13.25,17.34 15.11,15.47 15.11,12.8 16.45,11.47 TP2.TP
RS
  TopSignals 0.178: IC1.11 65.52,50.41 65.52,58.41 65.61,58.5 65.61,61.96 55.3,72.28 51.56,72.28 50.67,73.17 50.67,73.88 49.61,74.94 44.27,74.94 36.63,67.3 36.63,59.74 LCD1.4

### Text on the board
tNames: Remote Display / V1.0 / Dan Durusky 2014